# Altium schematic sheet 核心板.SchDoc
size A4
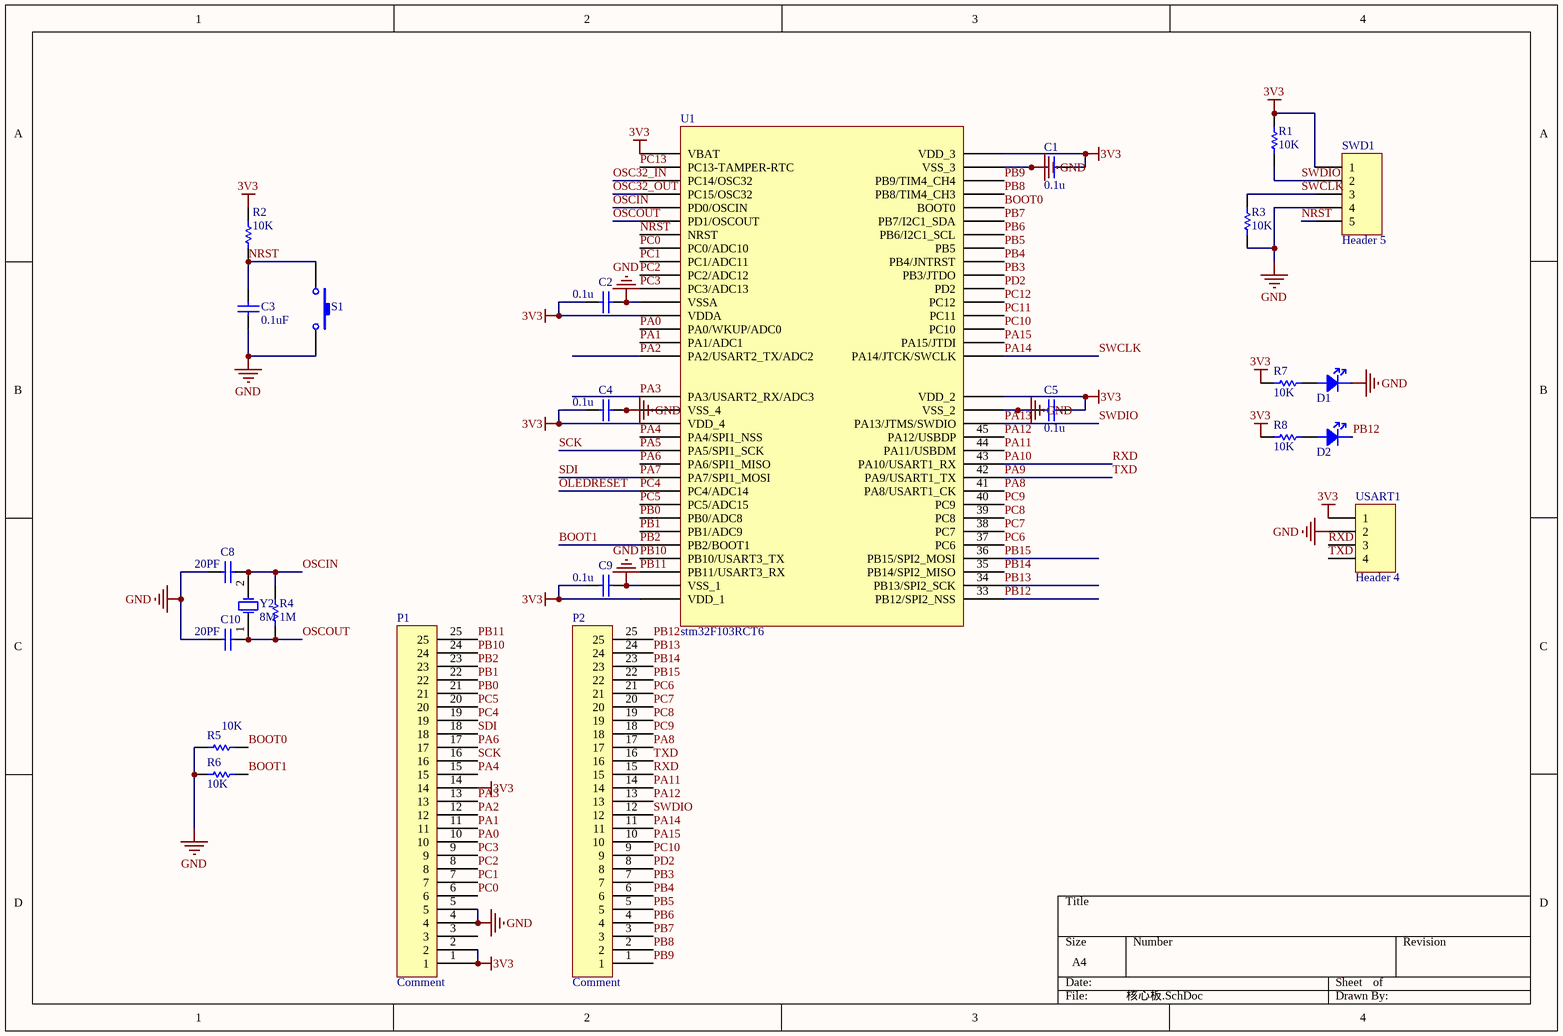
[diagram p0: 核心板.SchDoc]

## Parts
C1  value 0.1u  [CAP-MLCC-0603]  (hidden comment: Cap)
C2  value 0.1u  [CAP-MLCC-0603]  (hidden comment: Cap)
C3  value 0.1uF  [CAP-MLCC-0603]  (hidden comment: Cap)
C4  value 0.1u  [CAP-MLCC-0603]  (hidden comment: Cap)
C5  value 0.1u  [CAP-MLCC-0603]  (hidden comment: Cap)
C8  value 20PF  [CAP-MLCC-0603]  (hidden comment: Cap)
C9  value 0.1u  [CAP-MLCC-0603]  (hidden comment: Cap)
C10  value 20PF  [CAP-MLCC-0603]  (hidden comment: Cap)
D1  lED  [0805D]  (value not drawn)
D2  lED  [0805D]  (value not drawn)
P1  Comment  [HDR1X25_1.27]
P2  Comment  [HDR1X25_1.27]
R1  value 10K  [RES-0603]  (hidden comment: Res1)
R2  value 10K  [RES-0603]  (hidden comment: Res1)
R3  value 10K  [RES-0603]  (hidden comment: Res1)
R4  value 1M  [RES-0603]  (hidden comment: Res1)
R5  value 10K  [RES-0603]  (hidden comment: Res1)
R6  value 10K  [RES-0603]  (hidden comment: Res1)
R7  value 10K  [RES-0603]  (hidden comment: Res1)
R8  value 10K  [RES-0603]  (hidden comment: Res1)
S1  SW-PB  [key - duplicate]  (value not drawn)
SWD1  Header 5  [HDR1X5]
U1  stm32F103RCT6  [STM32F103RCT6]
USART1  Header 4  [HDR1X4]
Y2  8M  [Osc-6032]

## Nets
3V3: C1.1 C2.1 C4.1 C5.1 C9.1 P1.1 P1.2 P1.14 R1.2 R2.2 R7.2 R8.2 SWD1.1 U1.1(VBAT) U1.13(VDDA) U1.19(VDD_4) U1.32(VDD_1) U1.48(VDD_2) U1.64(VDD_3) USART1.1
GND: C1.2 C2.2 C3.2 C4.2 C5.2 C8.1 C9.2 C10.1 D1.K P1.4 P1.5 R3.2 R5.2 R6.2 S1.2 SWD1.4 U1.12(VSSA) U1.18(VSS_4) U1.31(VSS_1) U1.47(VSS_2) U1.63(VSS_3) USART1.2
BOOT0: R5.1 U1.60(BOOT0)
BOOT1: P1.23 R6.1 U1.28(PB2/BOOT1)  [also labelled PB2]
NRST: C3.1 R2.1 S1.1 SWD1.5 U1.7(NRST)
OLEDRESET: P1.19 U1.24(PC4/ADC14)  [also labelled PC4]
OSC32_IN: U1.3(PC14/OSC32)
OSC32_OUT: U1.4(PC15/OSC32)
OSCIN: C8.2 R4.2 U1.5(PD0/OSCIN) Y2.2(OSC2)
OSCOUT: C10.2 R4.1 U1.6(PD1/OSCOUT) Y2.1(OSC1)
PA0: P1.10 U1.14(PA0/WKUP/ADC0)
PA1: P1.11 U1.15(PA1/ADC1)
PA2: P1.12 U1.16(PA2/USART2_TX/ADC2)
PA3: P1.13 U1.17(PA3/USART2_RX/ADC3)
PA4: P1.15 U1.20(PA4/SPI1_NSS)
PA5: P1.16 U1.21(PA5/SPI1_SCK)  [also labelled SCK]
PA6: P1.17 U1.22(PA6/SPI1_MISO)
PA7: P1.18 U1.23(PA7/SPI1_MOSI)  [also labelled SDI]
PA8: P2.17 U1.41(PA8/USART1_CK)
PA9: P2.16 U1.42(PA9/USART1_TX) USART1.4  [also labelled TXD]
PA10: P2.15 U1.43(PA10/USART1_RX) USART1.3  [also labelled RXD]
PA11: P2.14 U1.44(PA11/USBDM)
PA12: P2.13 U1.45(PA12/USBDP)
PA13: P2.12 R1.1 SWD1.2 U1.46(PA13/JTMS/SWDIO)  [also labelled SWDIO]
PA14: P2.11 R3.1 SWD1.3 U1.49(PA14/JTCK/SWCLK)  [also labelled SWCLK]
PA15: P2.10 U1.50(PA15/JTDI)
PB0: P1.21 U1.26(PB0/ADC8)
PB1: P1.22 U1.27(PB1/ADC9)
PB3: P2.7 U1.55(PB3/JTDO)
PB4: P2.6 U1.56(PB4/JNTRST)
PB5: P2.5 U1.57(PB5)
PB6: P2.4 U1.58(PB6/I2C1_SCL)
PB7: P2.3 U1.59(PB7/I2C1_SDA)
PB8: P2.2 U1.61(PB8/TIM4_CH3)
PB9: P2.1 U1.62(PB9/TIM4_CH4)
PB10: P1.24 U1.29(PB10/USART3_TX)
PB11: P1.25 U1.30(PB11/USART3_RX)
PB12: D2.K P2.25 U1.33(PB12/SPI2_NSS)
PB13: P2.24 U1.34(PB13/SPI2_SCK)
PB14: P2.23 U1.35(PB14/SPI2_MISO)
PB15: P2.22 U1.36(PB15/SPI2_MOSI)
PC0: P1.6 U1.8(PC0/ADC10)
PC1: P1.7 U1.9(PC1/ADC11)
PC2: P1.8 U1.10(PC2/ADC12)
PC3: P1.9 U1.11(PC3/ADC13)
PC5: P1.20 U1.25(PC5/ADC15)
PC6: P2.21 U1.37(PC6)
PC7: P2.20 U1.38(PC7)
PC8: P2.19 U1.39(PC8)
PC9: P2.18 U1.40(PC9)
PC10: P2.9 U1.51(PC10)
PC11: U1.52(PC11)
PC12: U1.53(PC12)
PC13: U1.2(PC13-TAMPER-RTC)
PD2: P2.8 U1.54(PD2)
NetD1_A: D1.A R7.1
NetD2_A: D2.A R8.1

Not connected (* = marked no-connect by the designer): P1 3

## Library data of the parts
C1 C2 C4 C5 C8-C10 = Cap_1: Capacitor; Published: 8-Jun-2000; LatestRevisionDate: 17-Jul-2002; LatestRevisionNote: Re-released for DXP Platform.; PackageReference: RAD-0.3; Publisher: Altium Limited
C3 = Cap: Capacitor; Published: 8-Jun-2000; LatestRevisionDate: 17-Jul-2002; LatestRevisionNote: Re-released for DXP Platform.; PackageReference: RAD-0.3; Publisher: Altium Limited
D1 D2 = 00-D-LED
P1 P2 = Header 25: Header, 25-Pin; LatestRevisionDate: 17-Jul-2002; LatestRevisionNote: Re-released for DXP Platform.; Publisher: Altium Limited
R1-R8 = Res1_1: Resistor; Published: 8-Jun-2000; LatestRevisionDate: 17-Jul-2002; LatestRevisionNote: Re-released for DXP Platform.; PackageReference: AXIAL-0.3; Publisher: Altium Limited
S1 = SW-PB: Switch; Published: 24-Mar-1999; LatestRevisionDate: 17-Jul-2002; LatestRevisionNote: Re-released for DXP Platform.; PackageReference: SPST-2; Publisher: Altium Limited; PackageDescription: Switch; 2 Leads
SWD1 = Header 5: Header, 5-Pin; LatestRevisionDate: 17-Jul-2002; LatestRevisionNote: Re-released for DXP Platform.; Publisher: Altium Limited
USART1 = Header 4: Header, 4-Pin; LatestRevisionDate: 17-Jul-2002; LatestRevisionNote: Re-released for DXP Platform.; Publisher: Altium Limited
Y2 = C-Osc: Crystal Oscillator; Published: 8-Jun-2000; LatestRevisionDate: 17-Jul-2002; LatestRevisionNote: Re-released for DXP Platform.; PackageReference: R38; Publisher: Altium Limited; PackageDescription: Crystal, Thru-Hole; 2 Leads; Body 3.1 x 8.2 mm (Dia.xH)